# Altium schematic sheet [02] - GSM.SchDoc
size A4
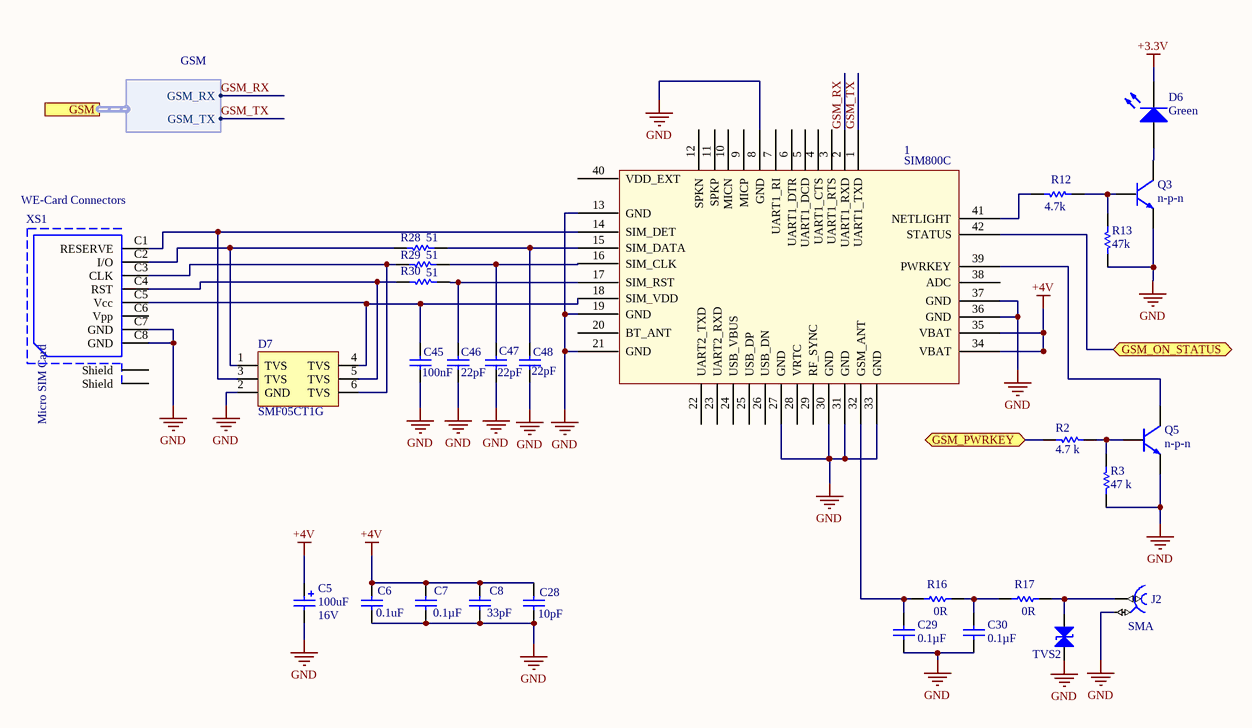
[diagram p0: [02] - GSM.SchDoc]

## Parts
1  SIM800C
C5  Capacitance: 100uF  Voltage - Rated: 16V  [Tantalum 3216 A]  (hidden comment: Capacitor Polarized)
C6  Capacitance: 0.1uF  [Cap 0603]  (hidden comment: Capacitor)
C7  Capacitance: 0.1µF  [Cap 0603]  (hidden comment: Capacitor)
C8  Capacitance: 33pF  [Cap 0603]  (hidden comment: Capacitor)
C28  Capacitance: 10pF  [Cap 0603]  (hidden comment: Capacitor)
C29  Capacitance: 0.1µF  [Cap 0603]  (hidden comment: Capacitor)
C30  Capacitance: 0.1µF  [Cap 0603]  (hidden comment: Capacitor)
C45  Capacitance: 100nF  [Cap 0603]  (hidden comment: Capacitor)
C46  Capacitance: 22pF  [Cap 0603]  (hidden comment: Capacitor)
C47  Capacitance: 22pF  [Cap 0603]  (hidden comment: Capacitor)
C48  Capacitance: 22pF  [Cap 0603]  (hidden comment: Capacitor)
D6  Colour: Green  [Led 0805 green]  (hidden comment: LED)
D7  SMF05CT1G  [TSSOP6]
J2  SMA  [AMPHENOL_132134]
Q3  n-p-n
Q5  n-p-n
R2  Resistance: 4.7 k  [Res-0603]  (hidden comment: Res1)
R3  Resistance: 47 k  [Res-0603]  (hidden comment: Res1)
R12  Resistance: 4.7k  [Res-0603]  (hidden comment: Res1)
R13  Resistance: 47k  [Res-0603]  (hidden comment: Res1)
R16  Resistance: 0R  [Res-0603]  (hidden comment: Res1)
R17  Resistance: 0R  [Res-0603]  (hidden comment: Res1)
R28  Resistance: 51  [Res-0603]  (hidden comment: Res1)
R29  Resistance: 51  [Res-0603]  (hidden comment: Res1)
R30  Resistance: 51  [Res-0603]  (hidden comment: Res1)
TVS2  LXE15AAA1-153  (value not drawn)
XS1  WE-Card Connectors  [693022010811]

## Ports
GSM (harness GSM), GSM_ON_STATUS, GSM_PWRKEY

## Harnesses
GSM: GSM_RX, GSM_TX

## Nets
+3.3V: D6.2(K)
+4V: 1.34(VBAT) 1.35(VBAT) C5.1 C6.2 C7.2 C8.2 C28.2
GND: 1.8(GND) 1.13(GND) 1.19(GND) 1.21(GND) 1.27(GND) 1.30(GND) 1.31(GND) 1.33(GND) 1.36(GND) 1.37(GND) C5.2 C6.1 C7.1 C8.1 C28.1 C29.1 C30.1 C45.1 C46.1 C47.1 C48.1 D7.2(GND) J2.2 Q3.17 Q5.17 R3.1 R13.1 TVS2.16 XS1.C7(GND) XS1.C8(GND)
GSM_ON_STATUS: 1.42(STATUS) ; port GSM_ON_STATUS
GSM_PWRKEY: R2.2 ; port GSM_PWRKEY
GSM_RX: 1.2(UART1_RXD) ; port GSM.GSM_RX
GSM_TX: 1.1(UART1_TXD) ; port GSM.GSM_TX
Net1_14: 1.14(SIM_DET) D7.3(TVS) XS1.C1(RESERVE)
Net1_15: 1.15(SIM_DATA) C48.2 R28.1
Net1_16: 1.16(SIM_CLK) C47.2 R29.1
Net1_17: 1.17(SIM_RST) C46.2 R30.1
Net1_18: 1.18(SIM_VDD) C45.2 D7.4(TVS) XS1.C5(Vcc)
Net1_32: 1.32(GSM_ANT) C29.2 R16.2
Net1_39: 1.39(PWRKEY) Q5.16
Net1_41: 1.41(NETLIGHT) R12.1
NetC30_2: C30.2 R16.1 R17.2
NetD6_1: D6.1(A) Q3.16
NetD7_1: D7.1(TVS) R28.2 XS1.C2(I/O)
NetD7_5: D7.5(TVS) R30.2 XS1.C4(RST)
NetD7_6: D7.6(TVS) R29.2 XS1.C3(CLK)
NetJ2_1: J2.1 R17.1 TVS2.16
NetQ3_15: Q3.15(PG) R12.2 R13.2
NetQ5_15: Q5.15(PG) R2.1 R3.2

Not connected (* = marked no-connect by the designer): 1 3(UART1_RTS) 4(UART1_CTS) 5(UART1_DCD) 6(UART1_DTR) 7(UART1_RI) 9(MICP) 10(MICN) 11(SPKP) 12(SPKN) 20(BT_ANT) 22(UART2_TXD) 23(UART2_RXD) 24(USB_VBUS) 25(USB_DP) 26(USB_DN) 28(VRTC) 29(RF_SYNC) 38(ADC) 40(VDD_EXT); XS1 C6(Vpp) Z1(Shield) Z2(Shield)

## Notes on the sheet
- Title
- Size:
- Date:
- A4
- Number:
- Time:
- Revision:
- Sheet
- of
- File:
- (in symbol WE-Card Connectors 693022010811) Micro SIM Card

## Library data of the parts
1 = SIM800C: GSM/GPS module
C5 = 2: Tantalum Capacitor; Manufacturer: Kemet; Manufacturer Part Number: T491A106K016AT; Manufacturer Size Code: A; Tolerance: ±10%; ESR (Equivalent Series Resistance): 7 Ohm; Type: Molded; Lifetime @ Temp.: 2000 Hrs @ 85°C; Supplier 1: Digi-Key; Supplier Part Number 1: 399-8269-1-ND; RoHS: RoHS Compliant; Category: Capacitors; Stock 1: 46669; Pricing 1: 1=0.41, 10=0.362, 50=0.2198, 100=0.181, 250=0.14476, 500=0.13184, 1000=0.11891 (USD); Packaging: Cut Tape (CT); Operating Temperature: -55°C ~ 125°C; Mounting Type: Surface Mount; Package / Case: 1206 (3216 Metric); Size / Dimension: 0.126" L x 0.063" W (3.20mm x 1.60mm); Height - Seated (Max): 0.071" (1.80mm); Lead Spacing: -; Features: General Purpose; ComponentLink1URL: http://www.kemet.com/Lists/ProductCatalog/Attachments/254/KEM_T2005_T491.pdf; ComponentLink1Description: http://www.kemet.com/Lists/ProductCatalog/Attachments/254/KEM_T2005_T491.pdf
C6 = 1: Chip Capacitor CER; Manufacturer: Kemet; Manufacturer Part Number: C0603C104K5RACTU; Tolerance: ±10%; Voltage - Rated: 50V; Temperature Coefficient: X7R; Supplier 1: Digi-Key; Supplier Part Number 1: 399-5089-1-ND; RoHS: RoHS Compliant; Category: Capacitors; Stock 1: 3992655; Pricing 1: 1=0.1, 10=0.041, 50=0.0222, 100=0.0187, 250=0.01532, 500=0.0131, 1000=0.0102 (USD); Packaging: Cut Tape (CT); Mounting Type: Surface Mount, MLCC; Operating Temperature: -55°C ~ 125°C; Applications: General Purpose; Ratings: -; Package / Case: 0603 (1608 Metric); Size / Dimension: 0.063" L x 0.031" W (1.60mm x 0.80mm); Height - Seated (Max): -; Thickness (Max): 0.034" (0.87mm); Lead Spacing: -; Features: -; Lead Style: -; ComponentLink1URL: http://www.kemet.com/docfinder?Partnumber=C0603C104K5RACTU; ComponentLink1Description: http://www.kemet.com/docfinder?Partnumber=C0603C104K5RACTU
C7 C8 C28-C30 C45-C48 = 1: Chip Capacitor Nonpolar; Manufacturer: Kemet; Manufacturer Part Number: C0603C104K5RACTU; Tolerance: ±10%; Voltage - Rated: 50V; Temperature Coefficient: X7R; Supplier 1: Digi-Key; Supplier Part Number 1: 399-5089-1-ND; RoHS: RoHS Compliant; Category: Capacitors; Stock 1: 3992655; Pricing 1: 1=0.1, 10=0.041, 50=0.0222, 100=0.0187, 250=0.01532, 500=0.0131, 1000=0.0102 (USD); Packaging: Cut Tape (CT); Mounting Type: Surface Mount, MLCC; Operating Temperature: -55°C ~ 125°C; Applications: General Purpose; Ratings: -; Package / Case: 0603 (1608 Metric); Size / Dimension: 0.063" L x 0.031" W (1.60mm x 0.80mm); Height - Seated (Max): -; Thickness (Max): 0.034" (0.87mm); Lead Spacing: -; Features: -; Lead Style: -; ComponentLink1URL: http://www.kemet.com/docfinder?Partnumber=C0603C104K5RACTU; ComponentLink1Description: http://www.kemet.com/docfinder?Partnumber=C0603C104K5RACTU
D6 = 3: Led 0805; Manufacturer: Vishay Lite-On; Manufacturer Part Number: LTST-S220GKT; ID: 3; Lens Colour: Clear,Colorless; Viewing Angle: 130°; Lens Style: Clear,Diffused,Colorless,Rectangular; Luminous Intensity: 10mcd; Forward Voltage: 2.1V; Forward Current: 30mA; Power Rating: 100mW; Dominant Wavelength: 569nm; Test Current: 20mA; Lens Transparency: Clear; Number of Elements: 1; Wavelength: 565nm; Reverse Voltage: 5V; Supplier 1: Digi-Key; Supplier Part Number 1: 160-1218-6-ND; Stock 1: 87001; Pricing 1: 1=0.27, 10=0.199, 25=0.1464, 100=0.1045, 250=0.07108, 500=0.0627, 1000=0.04912 (USD); Mount: Surface Mount; Case/Package: 0805; Number of Pins: 2; Case Code (Metric): 2012; Case Code (Imperial): 0805; Min Operating Temperature: -55°C; Max Operating Temperature: 85°C; Package Quantity: 1; Packaging: Tape and Reel; Illumination Colour: Green; Power Dissipation: 100mW; Number of LEDs: 1; Length: 2.1mm; Height: 0.6mm; Width: 1mm; Depth: 0.6mm; Radiation Hardening: No; Lead Free: Lead Free; ComponentLink1URL: https://datasheet.ciiva.com/2110/ltst-s220gkt-2110016.pdf; ComponentLink1Description: https://datasheet.ciiva.com/2110/ltst-s220gkt-2110016.pdf; ComponentLink2URL: https://datasheet.ciiva.com/11775/0900766b80dc0b6e-11775442.pdf; ComponentLink2Description: https://datasheet.ciiva.com/11775/0900766b80dc0b6e-11775442.pdf; ComponentLink3URL: https://datasheet.ciiva.com/15118/getdatasheetpartid-221136-15118117.pdf; ComponentLink3Description: https://datasheet.ciiva.com/15118/getdatasheetpartid-221136-15118117.pdf; ComponentLink4URL: https://datasheet.ciiva.com/2110/ltst-s220gkt-2110017.pdf; ComponentLink4Description: https://datasheet.ciiva.com/2110/ltst-s220gkt-2110017.pdf; ComponentLink5URL: https://datasheet.ciiva.com/16444/ltst-s220gkt-16444773.pdf; ComponentLink5Description: https://datasheet.ciiva.com/16444/ltst-s220gkt-16444773.pdf
D7 = SMF05CT1G: 5-Line Transient Voltage  Suppressor Array; Manufacturer: ON Semiconductor; Type: Zener; Unidirectional Channels: 5; Voltage - Reverse Standoff (Typ): 5V (Max); Voltage - Breakdown (Min): 6.2V; Voltage - Clamping (Max) @ Ipp: 12.5V; Current - Peak Pulse (10/1000µs): 8A (8/20µs); Power - Peak Pulse: 100W; Power Line Protection: No; Capacitance @ Frequency: 80pF @ 1MHz; Supplier 1: Digi-Key; Supplier Part Number 1: SMF05CT1GOSCT-ND; Manufacturer Part Number: SMF05CT1G; RoHS: RoHS Compliant; Category: Circuit Protection; Stock 1: 13951; Pricing 1: 1=0.59, 10=0.413, 25=0.3392, 100=0.2709, 250=0.19736, 500=0.16026, 1000=0.12319 (USD); Packaging: Cut Tape (CT); Bidirectional Channels: -; Applications: General Purpose; Operating Temperature: -40°C ~ 125°C; Mounting Type: Surface Mount; Package / Case: 6-TSSOP, SC-88, SOT-363; Supplier Device Package: SC-88/SC70-6/SOT-363; ComponentLink1URL: http://www.onsemi.com/pub_link/Collateral/SMF05C-D.PDF; ComponentLink1Description: http://www.onsemi.com/pub_link/Collateral/SMF05C-D.PDF
J2 = AMPHENOL_132134: Manufacturer: TE Connectivity; Manufacturer Part Number: 5-1814832-1; Body Material: Zinc; Plating: Nickel; Body Plating: Gold; Dielectric Material: PTFE; Impedance: 50R; Frequency: 3GHz; Gender: Female; Connector Type: Jack,SMA; Polarity: Normal; Wire/Cable Type: Coaxial; Insulation Resistance: 5GR; Connector System: Cable-to-Board; Number of Positions: 1; Sealable: No (Without); Tail Length: 4mm; Family: SMA; Author: CERN DEM JLC; Supplier 1: Digi-Key; Supplier Part Number 1: A97594-ND; Stock 1: 20161; Pricing 1: 1=2.21, 10=2.121, 25=1.944, 50=1.8556, 100=1.7673, 250=1.54636, 500=1.50218, 1000=1.32545 (USD); Mount: PCB,Through Hole; Case/Package: SMA; Contact Material: Bronze; Contact Plating: Gold; Insulation Material: Polytetrafluoroethylene; Min Operating Temperature: -67°C; Max Operating Temperature: 185°C; Package Quantity: 1; Fastening Type: Threaded; Packaging: Box; Termination: Through Hole; Max Frequency: 3GHz; Orientation: Straight; Length: 0.532inch; Depth: 6.4mm; Radiation Hardening: No; REACH SVHC: No SVHC; Lead Free: Lead Free; ELV: Compliant
Q3 Q5 = n-p-n transistor
R2 R3 = 1: Chip Resistor; Manufacturer: Panasonic; Manufacturer Part Number: ERJ-3GEYJ103V; Tolerance: 5%; Power Rating: 100mW; Voltage Rating: 75V; Temperature Coefficient: 200ppm/°C; Voltage Rating (DC): 50V; Supplier 1: Digi-Key; Supplier Part Number 1: P10KGDKR-ND; Stock 1: 10740434; Pricing 1: 1=0.1, 10=0.054, 100=0.022, 1000=0.00988, 2500=0.00858 (USD); Mount: Surface Mount; Case/Package: 0603; Weight: 7.1E-05oz; Case Code (Imperial): 0603; Case Code (Metric): 1608; Contact Plating: Tin; Min Operating Temperature: -55°C; Max Operating Temperature: 155°C; Packaging: Tape and Reel; Package Quantity: 1; Composition: Thick Film; Termination: SMD/SMT; Number of Terminations: 2; Military Standard: Not; Max Power Dissipation: 100mW; Working Voltage: 75V; Features: Automotive AEC-Q200; Length: 1.6mm; Height: 0.45mm; Width: 0.8mm; Depth: 0.8mm; REACH SVHC: No SVHC; Lead Free: Lead Free; ComponentLink1URL: https://datasheet.ciiva.com/34303/2007265-34303757.pdf; ComponentLink1Description: https://datasheet.ciiva.com/34303/2007265-34303757.pdf; ComponentLink2URL: https://datasheet.ciiva.com/11809/0900766b80f806dd-11809566.pdf; ComponentLink2Description: https://datasheet.ciiva.com/11809/0900766b80f806dd-11809566.pdf; ComponentLink3URL: https://datasheet.ciiva.com/28514/1678796-28514213.pdf; ComponentLink3Description: https://datasheet.ciiva.com/28514/1678796-28514213.pdf; ComponentLink4URL: https://datasheet.ciiva.com/30147/4aoa0000ce1-30147029.pdf; ComponentLink4Description: https://datasheet.ciiva.com/30147/4aoa0000ce1-30147029.pdf; ComponentLink5URL: https://datasheet.ciiva.com/46371/1678796-46371909.pdf; ComponentLink5Description: https://datasheet.ciiva.com/46371/1678796-46371909.pdf; ComponentLink6URL: https://datasheet.ciiva.com/24133/aoa0000ce1-37422-24133064.pdf; ComponentLink6Description: https://datasheet.ciiva.com/24133/aoa0000ce1-37422-24133064.pdf; ComponentLink7URL: https://datasheet.ciiva.com/46385/1678796-46385240.pdf; ComponentLink7Description: https://datasheet.ciiva.com/46385/1678796-46385240.pdf; ComponentLink8URL: https://datasheet.ciiva.com/17212/aoa0000ce1-17212106.pdf; ComponentLink8Description: https://datasheet.ciiva.com/17212/aoa0000ce1-17212106.pdf; ComponentLink9URL: https://datasheet.ciiva.com/9117/aoa0000ce1-9117038.pdf; ComponentLink9Description: https://datasheet.ciiva.com/9117/aoa0000ce1-9117038.pdf; ComponentLink10URL: https://datasheet.ciiva.com/16740/aoa0000ce1-16740655.pdf; ComponentLink10Description: https://datasheet.ciiva.com/16740/aoa0000ce1-16740655.pdf; ComponentLink11URL: https://datasheet.ciiva.com/48531/aoa0000ce1-48531887.pdf; ComponentLink11Description: https://datasheet.ciiva.com/48531/aoa0000ce1-48531887.pdf
R12 R13 R28-R30 = 1: Chip Resistor; Manufacturer: Panasonic; Manufacturer Part Number: ERJ-3EKF3300V; Tolerance: 1%; Power Rating: 100mW; Voltage Rating (DC): 75V; Temperature Coefficient: 100ppm/°C; ComponentLink1URL: http://industrial.panasonic.com/www-cgi/jvcr13pz.cgi?E+PZ+3+AOA0002+ERJ6ENF3000V+7+WW; ComponentLink1Description: http://industrial.panasonic.com/www-cgi/jvcr13pz.cgi?E+PZ+3+AOA0002+ERJ6ENF3000V+7+WW; Supplier 1: Digi-Key; Supplier Part Number 1: P330HDKR-ND; Stock 1: 924496; Pricing 1: 1=0.1, 10=0.079, 100=0.0323, 1000=0.01449, 2500=0.01258 (USD); Mount: Surface Mount; Case/Package: 0603; Number of Pins: 2; Weight: 7.1E-05oz; Case Code (Imperial): 0603; Case Code (Metric): 1608; Contact Plating: Tin; Min Operating Temperature: -55°C; Max Operating Temperature: 155°C; Packaging: Tape and Reel; Voltage Rating: 75V; Package Quantity: 1; Composition: Thick Film; Termination: SMD/SMT; Number of Terminations: 2; Military Standard: Not; Max Power Dissipation: 100mW; Features: Automotive AEC-Q200; Length: 1.6mm; Height: 0.022inch; Width: 0.8mm; Depth: 0.8mm; Radiation Hardening: No; REACH SVHC: No SVHC; Lead Free: Lead Free; ComponentLink2URL: https://datasheet.ciiva.com/7886/aoa0000ce2-7886729.pdf; ComponentLink2Description: https://datasheet.ciiva.com/7886/aoa0000ce2-7886729.pdf; ComponentLink3URL: https://datasheet.ciiva.com/48531/aoa0000ce2-48531001.pdf; ComponentLink3Description: https://datasheet.ciiva.com/48531/aoa0000ce2-48531001.pdf; ComponentLink4URL: https://datasheet.ciiva.com/22721/426256-22721099.pdf; ComponentLink4Description: https://datasheet.ciiva.com/22721/426256-22721099.pdf; ComponentLink5URL: https://datasheet.ciiva.com/46373/1678782-46373899.pdf; ComponentLink5Description: https://datasheet.ciiva.com/46373/1678782-46373899.pdf; ComponentLink6URL: https://datasheet.ciiva.com/9117/aoa0000ce2-9117132.pdf; ComponentLink6Description: https://datasheet.ciiva.com/9117/aoa0000ce2-9117132.pdf; ComponentLink7URL: https://datasheet.ciiva.com/46373/1678782-46373900.pdf; ComponentLink7Description: https://datasheet.ciiva.com/46373/1678782-46373900.pdf
R16 R17 = 1: Chip Resistor; Manufacturer: Panasonic; Manufacturer Part Number: ERJ-3GEY0R00V; Power Rating: 100mW; Voltage Rating: 75V; Tolerance: 0%; Temperature Coefficient: 600ppm/°C; Voltage Rating (DC): 50V; Supplier 1: Digi-Key; Supplier Part Number 1: P0.0GDKR-ND; Stock 1: 19868266; Pricing 1: 1=0.1, 10=0.053, 25=0.038, 50=0.029, 100=0.0214, 250=0.01632, 500=0.01306, 1000=0.00962 (USD); Mount: Surface Mount; Case/Package: 0603; Case Code (Metric): 1608; Case Code (Imperial): 0603; Contact Plating: Tin; Min Operating Temperature: -55°C; Max Operating Temperature: 155°C; Packaging: Tape and Reel; Package Quantity: 1; Composition: Thick Film; Number of Terminations: 2; Termination: SMD/SMT; Military Standard: Not; Max Power Dissipation: 100mW; Features: Automotive AEC-Q200; Length: 1.6mm; Height: 0.45mm; Width: 0.031inch; Depth: 0.8mm; Radiation Hardening: No; REACH SVHC: No SVHC; Lead Free: Lead Free; ComponentLink1URL: https://datasheet.ciiva.com/27055/1935748-27055113.pdf; ComponentLink1Description: https://datasheet.ciiva.com/27055/1935748-27055113.pdf; ComponentLink2URL: https://datasheet.ciiva.com/11808/0900766b80f806dd-11808207.pdf; ComponentLink2Description: https://datasheet.ciiva.com/11808/0900766b80f806dd-11808207.pdf; ComponentLink3URL: https://datasheet.ciiva.com/48532/aoa0000ce1-48532165.pdf; ComponentLink3Description: https://datasheet.ciiva.com/48532/aoa0000ce1-48532165.pdf; ComponentLink4URL: https://datasheet.ciiva.com/43460/1678796-43460647.pdf; ComponentLink4Description: https://datasheet.ciiva.com/43460/1678796-43460647.pdf; ComponentLink5URL: https://datasheet.ciiva.com/28695/1678796-28695833.pdf; ComponentLink5Description: https://datasheet.ciiva.com/28695/1678796-28695833.pdf; ComponentLink6URL: https://datasheet.ciiva.com/5959/1678796-5959707.pdf; ComponentLink6Description: https://datasheet.ciiva.com/5959/1678796-5959707.pdf; ComponentLink7URL: https://datasheet.ciiva.com/16834/aoa0000ce1-16834828.pdf; ComponentLink7Description: https://datasheet.ciiva.com/16834/aoa0000ce1-16834828.pdf; ComponentLink8URL: https://datasheet.ciiva.com/17215/aoa0000ce1-17215388.pdf; ComponentLink8Description: https://datasheet.ciiva.com/17215/aoa0000ce1-17215388.pdf; ComponentLink9URL: https://datasheet.ciiva.com/46377/1678796-46377868.pdf; ComponentLink9Description: https://datasheet.ciiva.com/46377/1678796-46377868.pdf; ComponentLink10URL: https://datasheet.ciiva.com/30199/4aoa0000ce1-30199822.pdf; ComponentLink10Description: https://datasheet.ciiva.com/30199/4aoa0000ce1-30199822.pdf; ComponentLink11URL: https://datasheet.ciiva.com/9198/aoa0000ce1-9198975.pdf; ComponentLink11Description: https://datasheet.ciiva.com/9198/aoa0000ce1-9198975.pdf; ComponentLink12URL: https://datasheet.ciiva.com/16758/70255313-16758527.pdf; ComponentLink12Description: https://datasheet.ciiva.com/16758/70255313-16758527.pdf
TVS2 = TVS-LXE15AAA1-153
XS1 = WE-Card Connectors 693022010811: WR-CRD Micro SIM_Hinge_8 pins; Manufacturer: Würth Elektronik eiSos GmbH; ComponentLink1 Description: Manufacturer; ComponentLink2 Description: Datasheet; NoPins: 8; ComponentLink1URL: http://www.we-online.de; ComponentLink2URL: http://katalog.we-online.de/em/datasheet/693022010811.pdf; Created by: Karrer Zheng; Created Date: 10/20/2014; partNo: 693022010811